# Altium schematic sheet Top.SchDoc
size B; DocumentNumber: 5; Revision: 1.1; SheetNumber: 1; SheetTotal: 4
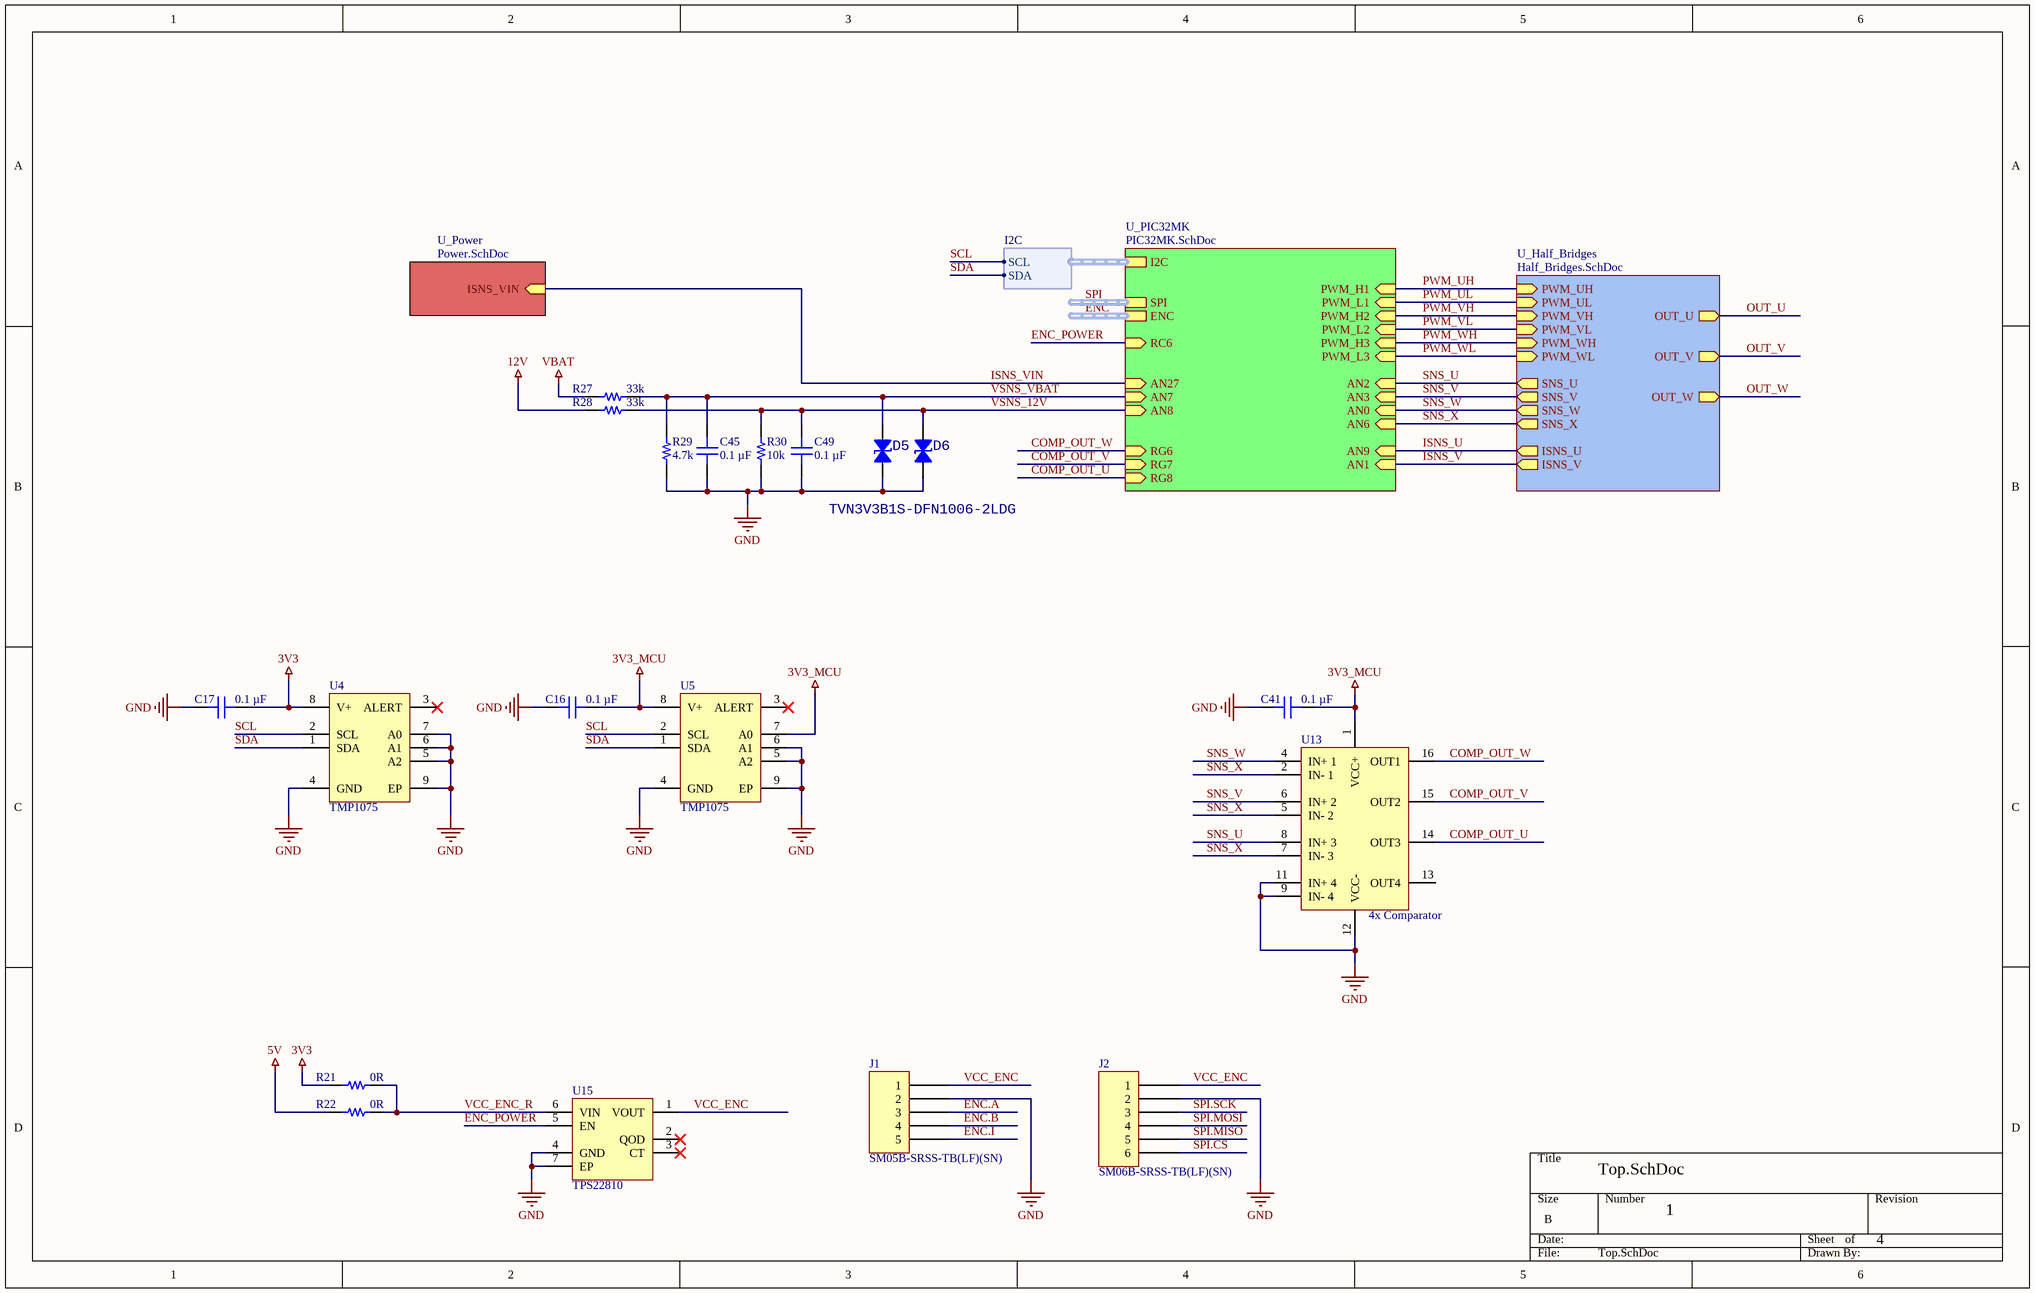
[diagram p0: Top.SchDoc]

## Parts
C16  0.1 µF  [CAP 0402_1005]
C17  0.1 µF  [CAP 0402_1005]
C41  0.1 µF  [CAP 0402_1005]
C45  0.1 µF  [CAP 0402_1005]
C49  0.1 µF  [CAP 0402_1005]
D5  TVN3V3B1S-DFN1006-2LDG  [0402]
D6  TVN3V3B1S-DFN1006-2LDG  [0402]  (value not drawn)
J1  SM05B-SRSS-TB(LF)(SN)  [JST SM05B-SRSS-TB]
J2  SM06B-SRSS-TB(LF)(SN)  [JST SM06B-SRSS-TB]
R21  0R  [RES_0402]
R22  0R  [RES_0402]
R27  33k  [RES_0402]
R28  33k  [RES_0402]
R29  4.7k  [RES_0402]
R30  10k  [RES_0402]
U4  TMP1075  [8_WSON_2x2_0.5mm]
U5  TMP1075  [8_WSON_2x2_0.5mm]
U13  4x Comparator  [QFN50P300X300X100-16N]
U15  TPS22810  [6-WSON_2x2_0.65mm]

## Sub-sheets
U_Half_Bridges = Half_Bridges.SchDoc: PWM_UH (in), PWM_UL (in), PWM_VH (in), PWM_VL (in), PWM_WH (in), PWM_WL (in), SNS_U (out), SNS_V (out), SNS_W (out), SNS_X (out), OUT_U (out), OUT_V (out), OUT_W (out), ISNS_U (out), ISNS_V (out)
U_PIC32MK = PIC32MK.SchDoc: I2C (harness I2C), PWM_L1 (in), PWM_H1 (in), PWM_L2 (in), PWM_H2 (in), PWM_L3 (in), PWM_H3 (in), ENC (harness ENC), AN9 (in), AN1 (in), AN6 (in), AN2 (in), AN3 (in), AN0 (in), RG6 (in), RG7 (in), RG8 (in), AN7 (in), AN8 (in), AN27 (in), SPI (harness SPI), RC6 (in)
U_Power = Power.SchDoc: ISNS_VIN (in)

## Harnesses
I2C: SCL, SDA

## Nets
3V3: C17.2 R21.2 U4.8(V+)
3V3_MCU: C16.2 C41.2 U5.7(A0) U5.8(V+) U13.1(VCC+)
5V: R22.2
12V: R28.2
GND: C16.1 C17.1 C41.1 C45.1 C49.1 D5.1 D6.1 J1.2 J2.2 R29.2 R30.2 U4.4(GND) U4.5(A2) U4.6(A1) U4.7(A0) U4.9(EP) U5.4(GND) U5.5(A2) U5.6(A1) U5.9(EP) U13.9(IN-_4) U13.11(IN+_4) U13.12(VCC-) U15.4(GND) U15.7(EP)
VBAT: R27.2
COMP_OUT_U: U13.14(OUT3) ; sheet U_PIC32MK/RG8
COMP_OUT_V: U13.15(OUT2) ; sheet U_PIC32MK/RG7
COMP_OUT_W: U13.16(OUT1) ; sheet U_PIC32MK/RG6
ENC.A: J1.3
ENC.B: J1.4
ENC.I: J1.5
ENC_POWER: U15.5(EN) ; sheet U_PIC32MK/RC6
ISNS_U: sheet U_PIC32MK/AN9, sheet U_Half_Bridges/ISNS_U
ISNS_V: sheet U_PIC32MK/AN1, sheet U_Half_Bridges/ISNS_V
ISNS_VIN: sheet U_PIC32MK/AN27, sheet U_Power/ISNS_VIN
OUT_U: sheet U_Half_Bridges/OUT_U
OUT_V: sheet U_Half_Bridges/OUT_V
OUT_W: sheet U_Half_Bridges/OUT_W
PWM_UH: sheet U_PIC32MK/PWM_H1, sheet U_Half_Bridges/PWM_UH
PWM_UL: sheet U_PIC32MK/PWM_L1, sheet U_Half_Bridges/PWM_UL
PWM_VH: sheet U_PIC32MK/PWM_H2, sheet U_Half_Bridges/PWM_VH
PWM_VL: sheet U_PIC32MK/PWM_L2, sheet U_Half_Bridges/PWM_VL
PWM_WH: sheet U_PIC32MK/PWM_H3, sheet U_Half_Bridges/PWM_WH
PWM_WL: sheet U_PIC32MK/PWM_L3, sheet U_Half_Bridges/PWM_WL
SCL: U4.2(SCL) U5.2(SCL) ; sheet U_PIC32MK/I2C.SCL
SDA: U4.1(SDA) U5.1(SDA) ; sheet U_PIC32MK/I2C.SDA
SNS_U: U13.8(IN+_3) ; sheet U_PIC32MK/AN2, sheet U_Half_Bridges/SNS_U
SNS_V: U13.6(IN+_2) ; sheet U_PIC32MK/AN3, sheet U_Half_Bridges/SNS_V
SNS_W: U13.4(IN+_1) ; sheet U_PIC32MK/AN0, sheet U_Half_Bridges/SNS_W
SNS_X: U13.2(IN-_1) U13.5(IN-_2) U13.7(IN-_3) ; sheet U_PIC32MK/AN6, sheet U_Half_Bridges/SNS_X
SPI.~{CS}: J2.6
SPI.MISO: J2.5
SPI.MOSI: J2.4
SPI.SCK: J2.3
VCC_ENC: J1.1 J2.1 U15.1(VOUT)
VCC_ENC_R: R21.1 R22.1 U15.6(VIN)
VSNS_12V: C49.2 D6.2 R28.1 R30.1 ; sheet U_PIC32MK/AN8
VSNS_VBAT: C45.2 D5.2 R27.1 R29.1 ; sheet U_PIC32MK/AN7

Not connected (* = marked no-connect by the designer): U4 3(ALERT)*; U5 3(ALERT)*; U13 13(OUT4); U15 2(QOD)* 3(CT)*

## Buses and harness runs
harness ENC = sheet U_PIC32MK/ENC
harness SPI = sheet U_PIC32MK/SPI

## Library data of the parts
C16 C17 C41 C45 C49 = C0402C104K4RACAUTO: CAP CER 0.1UF 16V X7R 0402; manufacturer: KEMET; Tolerance: ±10%; Part Number: C0402C104K4RACAUTO; Value: 0.1 µF; Applications: Automotive, Bypass, Decoupling; Capacitance: 0.1 µF; componentlink1description: Datasheet; componentlink1url: https://api.kemet.com/component-edge/download/specsheet/C0402C104K4RACAUTO.pdf; componentlink2description: DigiKey Link; componentlink2url: https://www.digikey.com/en/products/detail/kemet/C0402C104K4RACAUTO/3314827; Device Package: 0402 (1005 Metric); lastupdated: 2/9/2024 8:04:35 PM; Lifecycle Status: Active; Minimum Order: 1; Mounting Type: Surface Mount, MLCC; Operating Temperature: -55°C ~ 125°C; Package / Case: 0402 (1005 Metric); packaging: TapeAndReel; partid: 3024; Part Status: Active; price: 0.01; Ratings: AEC-Q200; series: SMD Auto X7R; Size / Dimension: 0.039" L x 0.020" W (1.00mm x 0.50mm); Supplier 1: DigiKey; Supplier Part Number 1: 399-6828-1-ND; Temperature Coefficient: X7R; Thickness (Max): 0.022" (0.55mm); Voltage - Rated: 16V
D5 D6 = TVN3V3B1S-DFN1006-2LDG: TVS DIODE 3.3V 14.2PF DFN1006; Manufacturer: INPAQ Technology Co., Ltd; Bidirectional Channels: 1; Capacitance @ Frequency: 11.5pF @ 1MHz; Current - Peak Pulse (10/1000µs): 8A (8/20µs); Power Line Protection: No; Type: Zener; Voltage - Breakdown (Min): 4V; Voltage - Clamping (Max) @ Ipp: 6.6V (Typ); Voltage - Reverse Standoff (Typ): 3.3V (Max); Part Number: TVN3V3B1S-DFN1006-2LDG; Applications: General Purpose; ComponentLink1Description: Datasheet; ComponentLink1URL: https://mm.digikey.com/Volume0/opasdata/d220001/medias/docus/5383/TVN3V3B1S-DFN1006-2LDG.pdf; ComponentLink2Description: DigiKey Link; ComponentLink2URL: https://www.digikey.com/en/products/detail/inpaq-technology-co-ltd/TVN3V3B1S-DFN1006-2LDG/20486686; Device Package: 0402 (1005 Metric); LastUpdated: 6/3/2024 8:22:57 PM; Lifecycle Status: Active; Minimum Order: 1; Mounting Type: Surface Mount; Operating Temperature: 150°C (TJ); Package / Case: 0402 (1005 Metric); Packaging: TapeAndReel; PartId: 11821; Price: 0.02; Series: TVN; Supplier 1: DigiKey; Supplier Part Number 1: 3526-TVN3V3B1S-DFN1006-2LDGCT-ND; Supplier Device Package: DFN1006
J1 = SM05B-SRSS-TB(LF)(SN): CONN HEADER SMD R/A 5POS 1MM; Manufacturer: JST Sales America Inc.; Current Rating (Amps): 0.7A; Material Flammability Rating: UL94 V-0; Number of Positions: 5; Number of Positions Loaded: All; Pitch - Mating: 0.039" (1.00mm); Shrouding: Shrouded - 4 Wall; Style: Board to Cable/Wire; Voltage Rating: 50V; Part Number: SM05B-SRSS-TB(LF)(SN); ComponentLink1Description: Datasheet; ComponentLink1URL: http://www.jst-mfg.com/product/pdf/eng/eSH.pdf; ComponentLink2Description: DigiKey Link; ComponentLink2URL: http://digikey.com/product-detail/en/jst-sales-america-inc/SM05B-SRSS-TB-LF-SN/455-1805-1-ND/926876; Connector Type: Header; Contact Finish - Mating: Tin; Contact Finish - Post: Tin; Contact Material: Copper Alloy; Contact Shape: Square; Contact Type: Male Pin; Fastening Type: Push-Pull; Features: Solder Retention; Insulation Color: Natural; Insulation Height: 0.114" (2.90mm); Insulation Material: Polyamide (PA), Nylon; LastUpdated: 1/12/2020 11:42:04 PM; Lifecycle Status: Active; Minimum Order: 1; Mounting Type: Surface Mount, Right Angle; Number of Rows: 1; Operating Temperature: -25°C ~ 85°C; Packaging: TapeAndReel; PartId: 63; Part Status: Active; Price: 0.32; Series: SR; Supplier 1: DigiKey; Supplier Part Number 1: 455-1805-1-ND; Termination: Solder
J2 = SM06B-SRSS-TB(LF)(SN): CONN HEADER SMD R/A 6POS 1MM; Manufacturer: JST Sales America Inc.; Current Rating (Amps): 0.7A; Material Flammability Rating: UL94 V-0; Number of Positions: 6; Number of Positions Loaded: All; Pitch - Mating: 0.039" (1.00mm); Shrouding: Shrouded - 4 Wall; Style: Board to Cable/Wire; Voltage Rating: 50V; Part Number: SM06B-SRSS-TB(LF)(SN); ComponentLink1Description: Datasheet; ComponentLink1URL: http://www.jst-mfg.com/product/pdf/eng/eSH.pdf; ComponentLink2Description: DigiKey Link; ComponentLink2URL: http://digikey.com/product-detail/en/jst-sales-america-inc/SM06B-SRSS-TB-LF-SN/455-1806-1-ND/926877; Connector Type: Header; Contact Finish - Mating: Tin; Contact Finish - Post: Tin; Contact Material: Copper Alloy; Contact Shape: Square; Contact Type: Male Pin; Fastening Type: Push-Pull; Features: Solder Retention; Insulation Color: Natural; Insulation Height: 0.114" (2.90mm); Insulation Material: Polyamide (PA), Nylon; LastUpdated: 1/12/2020 11:42:14 PM; Lifecycle Status: Active; Minimum Order: 1; Mounting Type: Surface Mount, Right Angle; Number of Rows: 1; Operating Temperature: -25°C ~ 85°C; Packaging: TapeAndReel; PartId: 64; Part Status: Active; Price: 0.36; Series: SR; Supplier 1: DigiKey; Supplier Part Number 1: 455-1806-1-ND; Termination: Solder
R21 R22 R27-R30 = RES_0402: RES 0402
U4 U5 = TMP1075: I2C TEMP SENSOR
U13 = LM2901Q4T: Comparator General Purpose CMOS, DTL, MOS, Open-Collector, TTL 16-QFN (3x3)
U15 = TPS22810DRVR: Load switch TPS22810DRVR